# Altium schematic sheet MCU.SchDoc
size A; SheetNumber: 6; SheetTotal: 6
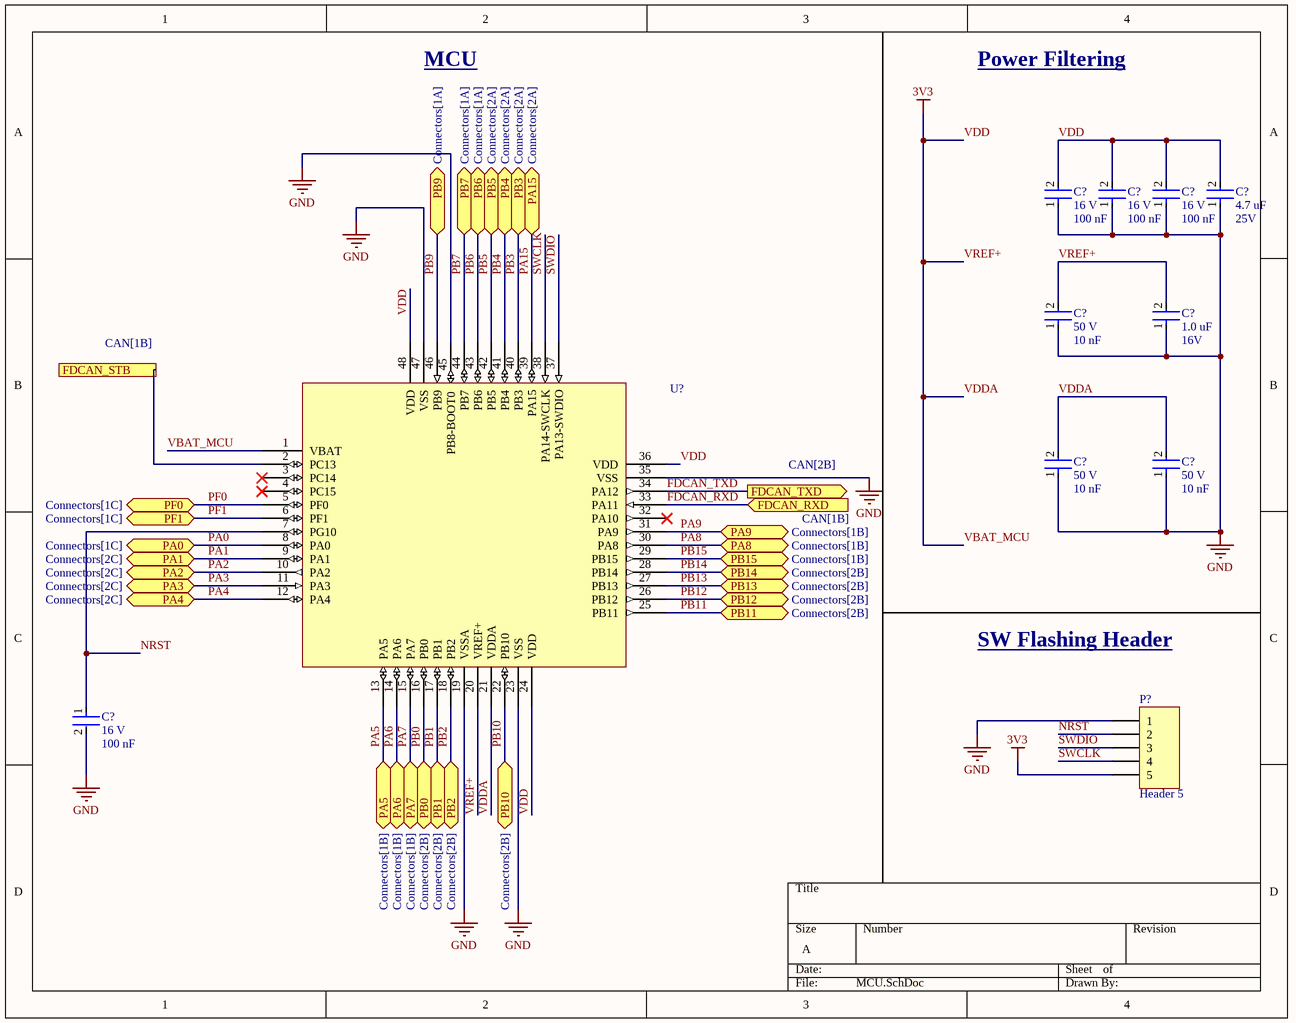
[diagram p0: MCU.SchDoc]

## Parts
(Parts that share a designator on the sheet are numbered #1, #2 ... from top to bottom, then left to right.)
C?#1  Voltage Rating: 16 V  Capacitance: 100 nF  [CAP-0402]  (hidden comment: CC0402KRX7R7BB104)
C?#2  Voltage Rating: 16 V  Capacitance: 100 nF  [CAP-0402]  (hidden comment: CC0402KRX7R7BB104)
C?#3  Voltage Rating: 16 V  Capacitance: 100 nF  [CAP-0402]  (hidden comment: CC0402KRX7R7BB104)
C?#4  Capacitance: 4.7 uF  Voltage: 25V  [CAP-0603]  (hidden comment: CC0603KRX5R8BB475)
C?#5  Voltage: 50 V  Capacitance: 10 nF  [CAP-0603]  (hidden comment: CC0603KPX7R9BB103)
C?#6  Capacitance: 1.0 uF  Voltage: 16V  [CAP-0603]  (hidden comment: CC0603KRX7R7BB105)
C?#7  Voltage: 50 V  Capacitance: 10 nF  [CAP-0603]  (hidden comment: CC0603KPX7R9BB103)
C?#8  Voltage: 50 V  Capacitance: 10 nF  [CAP-0603]  (hidden comment: CC0603KPX7R9BB103)
C?#9  Voltage Rating: 16 V  Capacitance: 100 nF  [CAP-0402]  (hidden comment: CC0402KRX7R7BB104)
P?  Header 5  [HDR1X5]
U?  STM32G431CBT6  [IC-LQFP48]  (value not drawn)

## Ports
FDCAN_RXD (in, see CAN[1B]), FDCAN_STB (see CAN[1B]), FDCAN_TXD (out, see CAN[2B]), PA0 (bidir, see Connectors[1C]), PA1 (bidir, see Connectors[2C]), PA2 (bidir, see Connectors[2C]), PA3 (bidir, see Connectors[2C]), PA4 (bidir, see Connectors[2C]), PA5 (bidir, see Connectors[1B]), PA6 (bidir, see Connectors[1B]), PA7 (bidir, see Connectors[1B]), PA8 (bidir, see Connectors[1B]), PA9 (bidir, see Connectors[1B]), PA15 (bidir, see Connectors[2A]), PB0 (bidir, see Connectors[2B]), PB1 (bidir, see Connectors[2B]), PB2 (bidir, see Connectors[2B]), PB3 (bidir, see Connectors[2A]), PB4 (bidir, see Connectors[2A]), PB5 (bidir, see Connectors[2A]), PB6 (bidir, see Connectors[1A]), PB7 (bidir, see Connectors[1A]), PB9 (bidir, see Connectors[1A]), PB10 (bidir, see Connectors[2B]), PB11 (bidir, see Connectors[2B]), PB12 (bidir, see Connectors[2B]), PB13 (bidir, see Connectors[2B]), PB14 (bidir, see Connectors[2B]), PB15 (bidir, see Connectors[1B]), PF0 (bidir, see Connectors[1C]), PF1 (bidir, see Connectors[1C])

## Nets
GND: C?#1.1 C?#2.1 C?#3.1 C?#4.1 C?#5.1 C?#6.1 C?#7.1 C?#8.1 C?#9.2 P?.1 U?.19(VSSA) U?.23(VSS) U?.35(VSS) U?.45(PB8-BOOT0) U?.47(VSS)
VBAT_MCU: C?#1.2 C?#2.2 C?#3.2 C?#4.2 C?#5.2 C?#6.2 C?#7.2 C?#8.2 P?.5 U?.1(VBAT) U?.20(VREF+) U?.21(VDDA) U?.24(VDD) U?.36(VDD) U?.48(VDD)  [also labelled 3V3, VDD, VDDA, VREF+]
FDCAN_RXD: U?.33(PA11) ; port FDCAN_RXD
FDCAN_STB: U?.2(PC13) ; port FDCAN_STB
FDCAN_TXD: U?.34(PA12) ; port FDCAN_TXD
NRST: C?#9.1 P?.2 U?.7(PG10)
PA0: U?.8(PA0) ; port PA0
PA1: U?.9(PA1) ; port PA1
PA2: U?.10(PA2) ; port PA2
PA3: U?.11(PA3) ; port PA3
PA4: U?.12(PA4) ; port PA4
PA5: U?.13(PA5) ; port PA5
PA6: U?.14(PA6) ; port PA6
PA7: U?.15(PA7) ; port PA7
PA8: U?.30(PA8) ; port PA8
PA9: U?.31(PA9) ; port PA9
PA15: U?.39(PA15) ; port PA15
PB0: U?.16(PB0) ; port PB0
PB1: U?.17(PB1) ; port PB1
PB2: U?.18(PB2) ; port PB2
PB3: U?.40(PB3) ; port PB3
PB4: U?.41(PB4) ; port PB4
PB5: U?.42(PB5) ; port PB5
PB6: U?.43(PB6) ; port PB6
PB7: U?.44(PB7) ; port PB7
PB9: U?.46(PB9) ; port PB9
PB10: U?.22(PB10) ; port PB10
PB11: U?.25(PB11) ; port PB11
PB12: U?.26(PB12) ; port PB12
PB13: U?.27(PB13) ; port PB13
PB14: U?.28(PB14) ; port PB14
PB15: U?.29(PB15) ; port PB15
PF0: U?.5(PF0) ; port PF0
PF1: U?.6(PF1) ; port PF1
SWCLK: P?.4 U?.38(PA14-SWCLK)
SWDIO: P?.3 U?.37(PA13-SWDIO)

Not connected (* = marked no-connect by the designer): U? 3(PC14)* 4(PC15)* 32(PA10)*

## Notes on the sheet
- MCU
- Power Filtering
- SW Flashing Header

## Library data of the parts
C?#1-C?#3 C?#9 = CAP-0.1U-0001: CAP CER 0.1UF 16V X7R 0402; ComponentLink2Description: Datasheet; ComponentLink2URL: https://www.yageo.com/upload/media/product/productsearch/datasheet/mlcc/UPY-GPHC_X7R_6.3V-to-250V_24.pdf; Device Class: Ceramic; Size: 0402
C?#4 = CAP-4.7U-0001: CAP CER 4.7UF 25V X5R 0603; Device Class: Ceramic; Size: 0603
C?#5 C?#7 C?#8 = CAP-10N-0002: CAP CER 10000PF 50V X7R 0603; ComponentLink2Description: Datasheet; ComponentLink2URL: http://www.yageo.com/documents/recent/UPY-GPHC_X7R_6.3V-to-50V_18.pdf; Device Class: Ceramic; Size: 0603
C?#6 = CAP-1U-0002: CAP CER 1UF 16V X7R 0603; Device Class: Ceramic; Size: 0603
P? = Header 5: Header, 5-Pin; LatestRevisionDate: 17-Jul-2002; LatestRevisionNote: Re-released for DXP Platform.; Publisher: Altium Limited
U? = IC-STM32G431CBT6: IC MCU 32BIT 128KB FLASH 48LQFP; Package: 48LQFP; ComponentLink1Description: Datasheet; ComponentLink1URL: https://www.st.com/resource/en/datasheet/stm32g431cb.pdf